# Altium schematic sheet Cover_Page.SchDoc: Septentrio Interleuvenlaan 15i 3001 Leuven Belgium
size 420 x 297 mm; Organization: Designed By ANAVS; Address1: Septentrio; logo: C:\users\laeti\Downloads\septentrio logo; Address4: Belgium; SheetNumber: 1; SheetTotal: 3
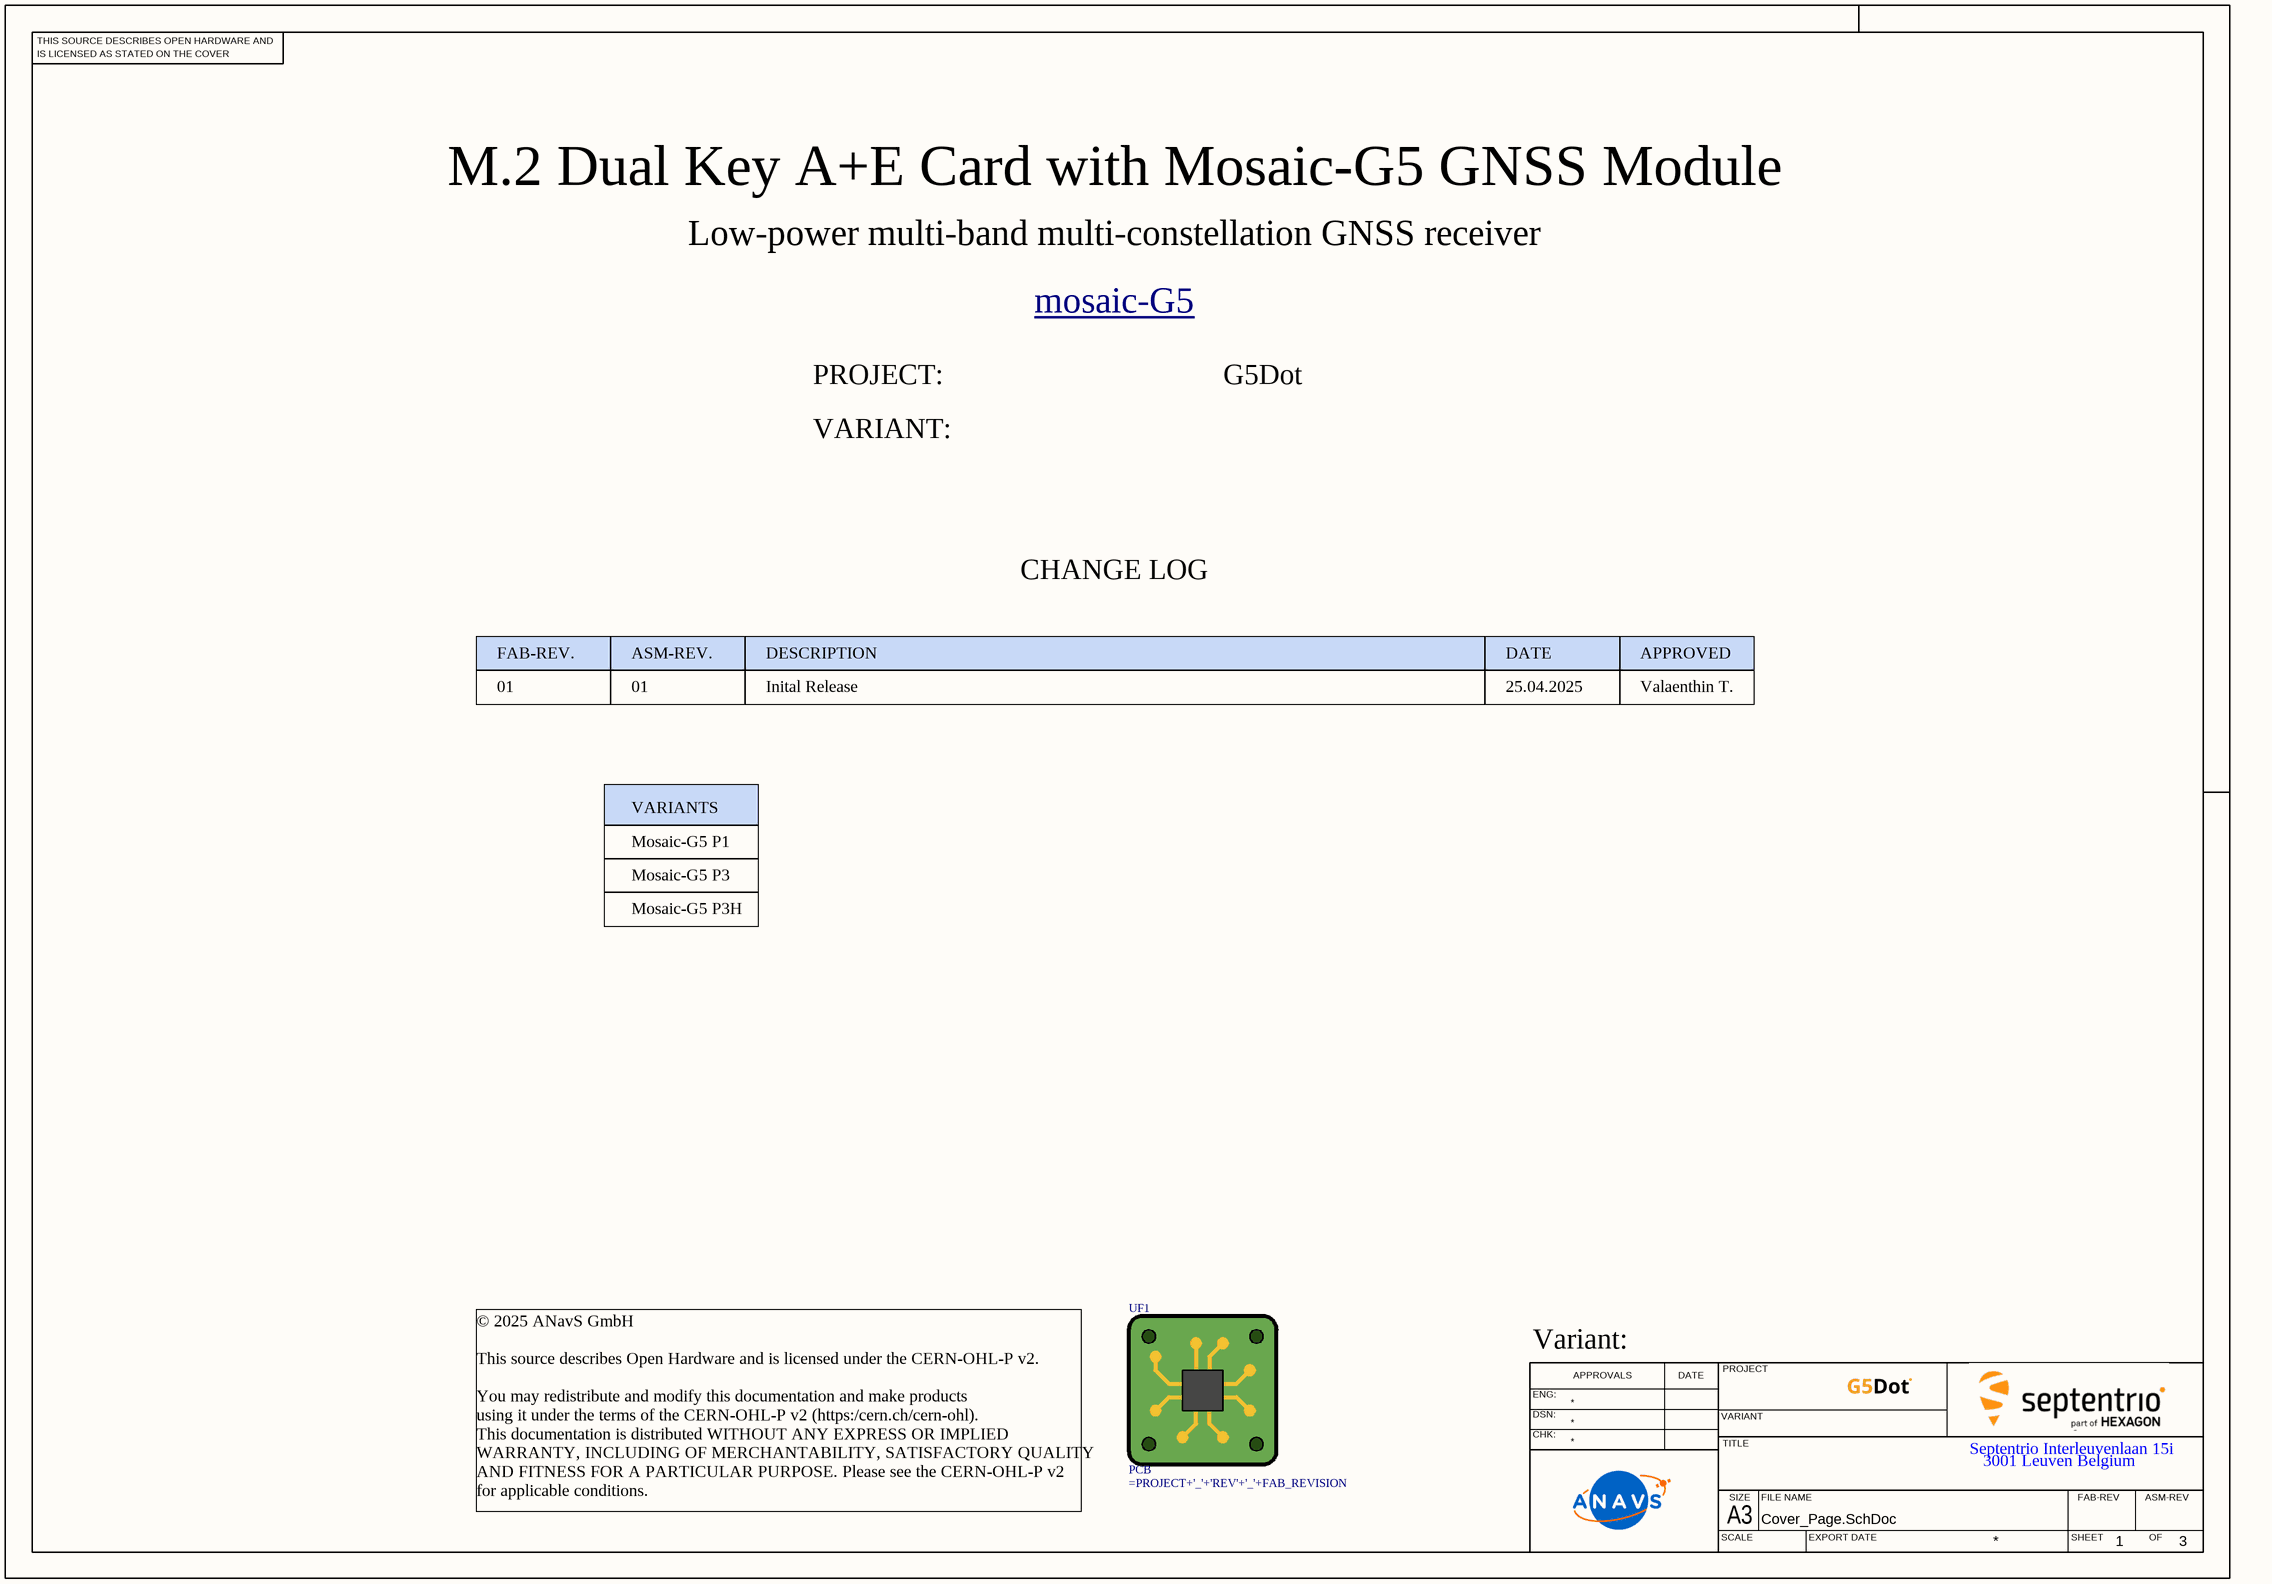
[diagram p0: Cover_Page.SchDoc]

## Parts
UF1  PCB  (mechanical)

## Notes on the sheet
- M.2 Dual Key A+E Card with Mosaic-G5 GNSS Module
- Low-power multi-band multi-constellation GNSS receiver
- mosaic-G5 <https://www.septentrio.com/en/septentrio-extends-its-mosaic-family>
- PROJECT:
- G5Dot
- VARIANT:
- CHANGE LOG
- FAB-REV.
- ASM-REV.
- DESCRIPTION
- DATE
- APPROVED
- 01
- Inital Release
- 25.04.2025
- Valaenthin T.
- VARIANTS
- Mosaic-G5 P1
- Mosaic-G5 P3
- Mosaic-G5 P3H
- Variant:
- Septentrio Interleuvenlaan 15i
- 3001 Leuven Belgium
- © 2025 ANavS GmbH
  This source describes Open Hardware and is licensed under the CERN-OHL-P v2.
  You may redistribute and modify this documentation and make products
  using it under the terms of the CERN-OHL-P v2 (https:/cern.ch/cern-ohl).
  This documentation is distributed WITHOUT ANY EXPRESS OR IMPLIED
  WARRANTY, INCLUDING OF MERCHANTABILITY, SATISFACTORY QUALITY
  AND FITNESS FOR A PARTICULAR PURPOSE. Please see the CERN-OHL-P v2
  for applicable conditions.
- THIS SOURCE DESCRIBES OPEN HARDWARE AND
- IS LICENSED AS STATED ON THE COVER
- ENG:
- APPROVALS
- PROJECT
- DSN:
- CHK:
- VARIANT
- TITLE
- SCALE
- A3
- SIZE
- FILE NAME
- EXPORT DATE
- SHEET
- FAB-REV
- ASM-REV
- OF

## Library data of the parts
UF1 = CMP-00001-7: Printed Circuit Board; Value: =PROJECT+'_'+'REV'+'_'+FAB_REVISION